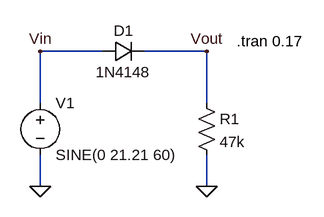
[diagram p0: schematic lab_2-circuito-47k.asc]
lab_2-circuito-47k.asc, the LTspice schematic file:
Version 4
SHEET 1 880 680
WIRE 160 -80 64 -80
WIRE 320 -80 224 -80
WIRE 64 0 64 -80
WIRE 320 0 320 -80
WIRE 64 128 64 80
WIRE 320 128 320 80
FLAG 64 128 0
FLAG 320 128 0
FLAG 64 -80 Vin
FLAG 320 -80 Vout
SYMBOL voltage 64 -16 R0
WINDOW 123 0 0 Left 0
WINDOW 39 0 0 Left 0
SYMATTR InstName V1
SYMATTR Value SINE(0 21.21 60)
SYMBOL diode 160 -64 R270
WINDOW 0 32 32 VTop 2
WINDOW 3 0 32 VBottom 2
SYMATTR InstName D1
SYMATTR Value 1N4148
SYMBOL res 304 -16 R0
SYMATTR InstName R1
SYMATTR Value 47k
TEXT 366 -96 Left 2 !.tran 0.17

The netlist it stands for:
* lab_2-circuito-47k.asc
V1 Vin 0 SINE(0 21.21 60)
D1 Vin Vout 1N4148
R1 Vout 0 47k
.model D D
.lib standard.dio
.tran 0.17
.backanno
.end

* Results of the author's LTspice run, read from the files saved beside the schematic
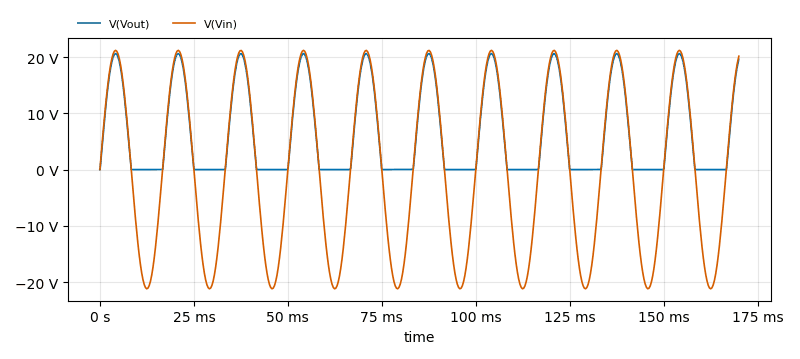
[diagram p1: Transient Analysis of lab_2-circuito-47k.asc, plotted from the saved traces]
* Transient Analysis, 1 run:
*   V(Vout): min -1.534 mV, max 20.64 V, average 6.573 V, rms 10.31 V, last 19.63 V
*   V(Vin): min -21.21 V, max 21.21 V, average 228.3 mV, rms 14.96 V, last 20.17 V